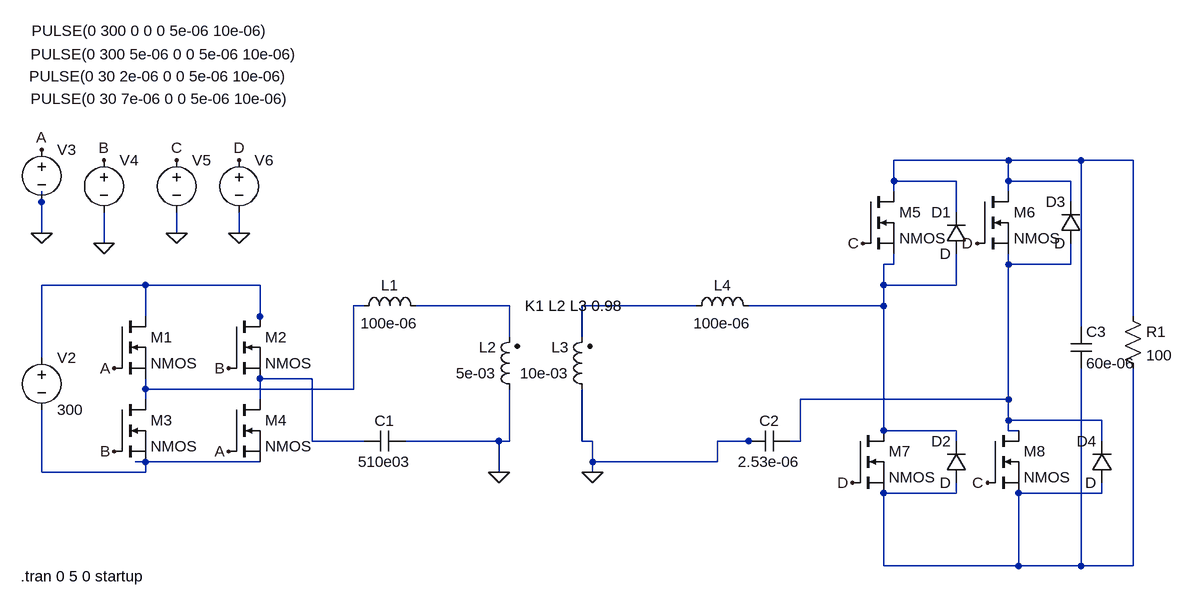
[diagram p0: schematic resonantcllc.asc]
resonantcllc.asc, the LTspice schematic file:
Version 4
SHEET 1 1668 680
WIRE 1392 -176 1216 -176
WIRE 1504 -176 1392 -176
WIRE 1584 -176 1504 -176
WIRE 1216 -144 1216 -176
WIRE 1312 -144 1216 -144
WIRE 1392 -144 1392 -176
WIRE 1488 -144 1392 -144
WIRE 1216 -128 1216 -144
WIRE 1392 -128 1392 -144
WIRE -96 -112 -96 -128
WIRE 1488 -112 1488 -144
WIRE 1312 -96 1312 -144
WIRE -96 -64 -96 -112
WIRE 112 -64 112 -96
WIRE 128 -64 112 -64
WIRE 208 -64 208 -96
WIRE 0 -48 0 -96
WIRE 1216 -16 1216 -32
WIRE 1216 -16 1200 -16
WIRE 1392 -16 1392 -32
WIRE 1488 -16 1488 -48
WIRE 1488 -16 1392 -16
WIRE 64 16 -96 16
WIRE 240 16 64 16
WIRE 1200 16 1200 -16
WIRE 1312 16 1312 -32
WIRE 1312 16 1200 16
WIRE 400 48 384 48
WIRE 624 48 480 48
WIRE 912 48 736 48
WIRE 1200 48 1200 16
WIRE 1200 48 992 48
WIRE 64 64 64 16
WIRE 240 64 240 16
WIRE 1584 64 1584 -176
WIRE 240 80 240 64
WIRE 1504 80 1504 -176
WIRE 624 96 624 48
WIRE 736 96 736 48
WIRE -96 128 -96 16
WIRE 320 160 240 160
WIRE 64 176 64 160
WIRE 384 176 384 48
WIRE 384 176 64 176
WIRE 64 192 64 176
WIRE 240 192 240 160
WIRE 1392 192 1392 -16
WIRE 1392 192 1072 192
WIRE 1392 224 1392 192
WIRE 1536 224 1392 224
WIRE 1200 240 1200 48
WIRE 1312 240 1200 240
WIRE 1392 240 1392 224
WIRE 1408 240 1392 240
WIRE 320 256 320 160
WIRE 400 256 320 256
WIRE 608 256 464 256
WIRE 624 256 624 176
WIRE 624 256 608 256
WIRE 736 256 736 176
WIRE 752 256 736 256
WIRE 992 256 944 256
WIRE 1008 256 992 256
WIRE 1072 256 1072 192
WIRE 1072 256 1056 256
WIRE 1312 256 1312 240
WIRE 1536 256 1536 224
WIRE 64 288 48 288
WIRE 240 288 64 288
WIRE 752 288 752 256
WIRE 944 288 944 256
WIRE 944 288 752 288
WIRE -96 304 -96 208
WIRE 64 304 64 288
WIRE 64 304 -96 304
WIRE 608 304 608 256
WIRE 752 304 752 288
WIRE 1312 336 1312 320
WIRE 1312 336 1200 336
WIRE 1536 336 1536 320
WIRE 1536 336 1408 336
WIRE 1200 448 1200 336
WIRE 1408 448 1408 336
WIRE 1408 448 1200 448
WIRE 1504 448 1504 144
WIRE 1504 448 1408 448
WIRE 1584 448 1584 144
WIRE 1584 448 1504 448
FLAG -96 -64 0
FLAG 0 -48 0
FLAG 112 -64 0
FLAG 208 -64 0
FLAG -96 -192 A
FLAG 0 -176 B
FLAG 112 -176 C
FLAG 208 -176 D
FLAG 16 144 A
FLAG 192 272 A
FLAG 16 272 B
FLAG 192 144 B
FLAG 1168 -48 C
FLAG 1360 320 C
FLAG 1152 320 D
FLAG 1344 -48 D
FLAG 608 304 0
FLAG 752 304 0
SYMBOL nmos 16 64 R0
SYMATTR InstName M1
SYMBOL nmos 192 64 R0
SYMATTR InstName M2
SYMBOL nmos 16 192 R0
SYMATTR InstName M3
SYMBOL nmos 192 192 R0
SYMATTR InstName M4
SYMBOL ind 384 64 R270
WINDOW 0 32 56 VTop 2
WINDOW 3 5 56 VBottom 2
SYMATTR InstName L1
SYMATTR Value 100e-06
SYMBOL cap 464 240 R90
WINDOW 0 0 32 VBottom 2
WINDOW 3 32 32 VTop 2
SYMATTR InstName C1
SYMATTR Value 510e03
SYMBOL ind2 640 192 R180
WINDOW 0 36 80 Left 2
WINDOW 3 36 40 Left 2
SYMATTR InstName L2
SYMATTR Value 5e-03
SYMATTR Type ind
SYMBOL ind2 752 192 R180
WINDOW 0 36 80 Left 2
WINDOW 3 36 40 Left 2
SYMATTR InstName L3
SYMATTR Value 10e-03
SYMATTR Type ind
SYMBOL ind 896 64 R270
WINDOW 0 32 56 VTop 2
WINDOW 3 5 56 VBottom 2
SYMATTR InstName L4
SYMATTR Value 100e-06
SYMBOL cap 992 272 R270
WINDOW 0 32 32 VTop 2
WINDOW 3 0 32 VBottom 2
SYMATTR InstName C2
SYMATTR Value 2.53e-06
SYMBOL nmos 1168 -128 R0
SYMATTR InstName M5
SYMBOL nmos 1344 -128 R0
SYMATTR InstName M6
SYMBOL nmos 1152 240 R0
SYMATTR InstName M7
SYMBOL nmos 1360 240 R0
SYMATTR InstName M8
SYMBOL voltage -96 112 R0
WINDOW 123 0 0 Left 0
WINDOW 39 0 0 Left 0
SYMATTR InstName V2
SYMATTR Value 300
SYMBOL voltage -96 -208 R0
WINDOW 3 -15 -167 Left 2
WINDOW 123 0 0 Left 0
WINDOW 39 0 0 Left 0
SYMATTR Value PULSE(0 300 0 0 0 5e-06 10e-06)
SYMATTR InstName V3
SYMBOL voltage 0 -192 R0
WINDOW 3 -113 -147 Left 2
WINDOW 123 0 0 Left 0
WINDOW 39 0 0 Left 0
SYMATTR Value PULSE(0 300 5e-06 0 0 5e-06 10e-06)
SYMATTR InstName V4
SYMBOL voltage 112 -192 R0
WINDOW 3 -227 -113 Left 2
WINDOW 123 0 0 Left 0
WINDOW 39 0 0 Left 0
SYMATTR Value PULSE(0 30 2e-06 0 0 5e-06 10e-06)
SYMATTR InstName V5
SYMBOL voltage 208 -192 R0
WINDOW 3 -321 -79 Left 2
WINDOW 123 0 0 Left 0
WINDOW 39 0 0 Left 0
SYMATTR Value PULSE(0 30 7e-06 0 0 5e-06 10e-06)
SYMATTR InstName V6
SYMBOL res 1568 48 R0
SYMATTR InstName R1
SYMATTR Value 100
SYMBOL cap 1488 80 R0
SYMATTR InstName C3
SYMATTR Value 60e-06
SYMBOL diode 1328 -32 R180
WINDOW 0 24 64 Left 2
WINDOW 3 24 0 Left 2
SYMATTR InstName D1
SYMBOL diode 1328 320 R180
WINDOW 0 24 64 Left 2
WINDOW 3 24 0 Left 2
SYMATTR InstName D2
SYMBOL diode 1504 -48 R180
WINDOW 0 24 64 Left 2
WINDOW 3 24 0 Left 2
SYMATTR InstName D3
SYMBOL diode 1552 320 R180
WINDOW 0 24 64 Left 2
WINDOW 3 24 0 Left 2
SYMATTR InstName D4
TEXT 648 48 Left 2 !K1 L2 L3 0.98
TEXT -128 464 Left 2 !.tran 0 5 0 startup

The netlist it stands for:
* resonantcllc.asc
M1 N004 A N005 N005 NMOS
M2 N004 B N008 N008 NMOS
M3 N005 B N009 N009 NMOS
M4 N008 A N009 N009 NMOS
L1 N005 N006 100e-06
C1 0 N008 510e03
L2 0 N006 5e-03
L3 0 N007 10e-03
L4 N007 N002 100e-06
C2 0 N003 2.53e-06
M5 N001 C N002 N002 NMOS
M6 N001 D N003 N003 NMOS
M7 N002 D N010 N010 NMOS
M8 N003 C N010 N010 NMOS
V2 N004 N009 300
V3 A 0 PULSE(0 300 0 0 0 5e-06 10e-06)
V4 B 0 PULSE(0 300 5e-06 0 0 5e-06 10e-06)
V5 C 0 PULSE(0 30 2e-06 0 0 5e-06 10e-06)
V6 D 0 PULSE(0 30 7e-06 0 0 5e-06 10e-06)
R1 N001 N010 100
C3 N001 N010 60e-06
D1 N002 N001 D
D2 N010 N002 D
D3 N003 N001 D
D4 N010 N003 D
.model D D
.lib standard.dio
.model NMOS NMOS
.model PMOS PMOS
.lib standard.mos
K1 L2 L3 0.98
.tran 0 5 0 startup
.backanno
.end